# EAGLE design pdm_1-rev0 (EAGLE 7.5.0)
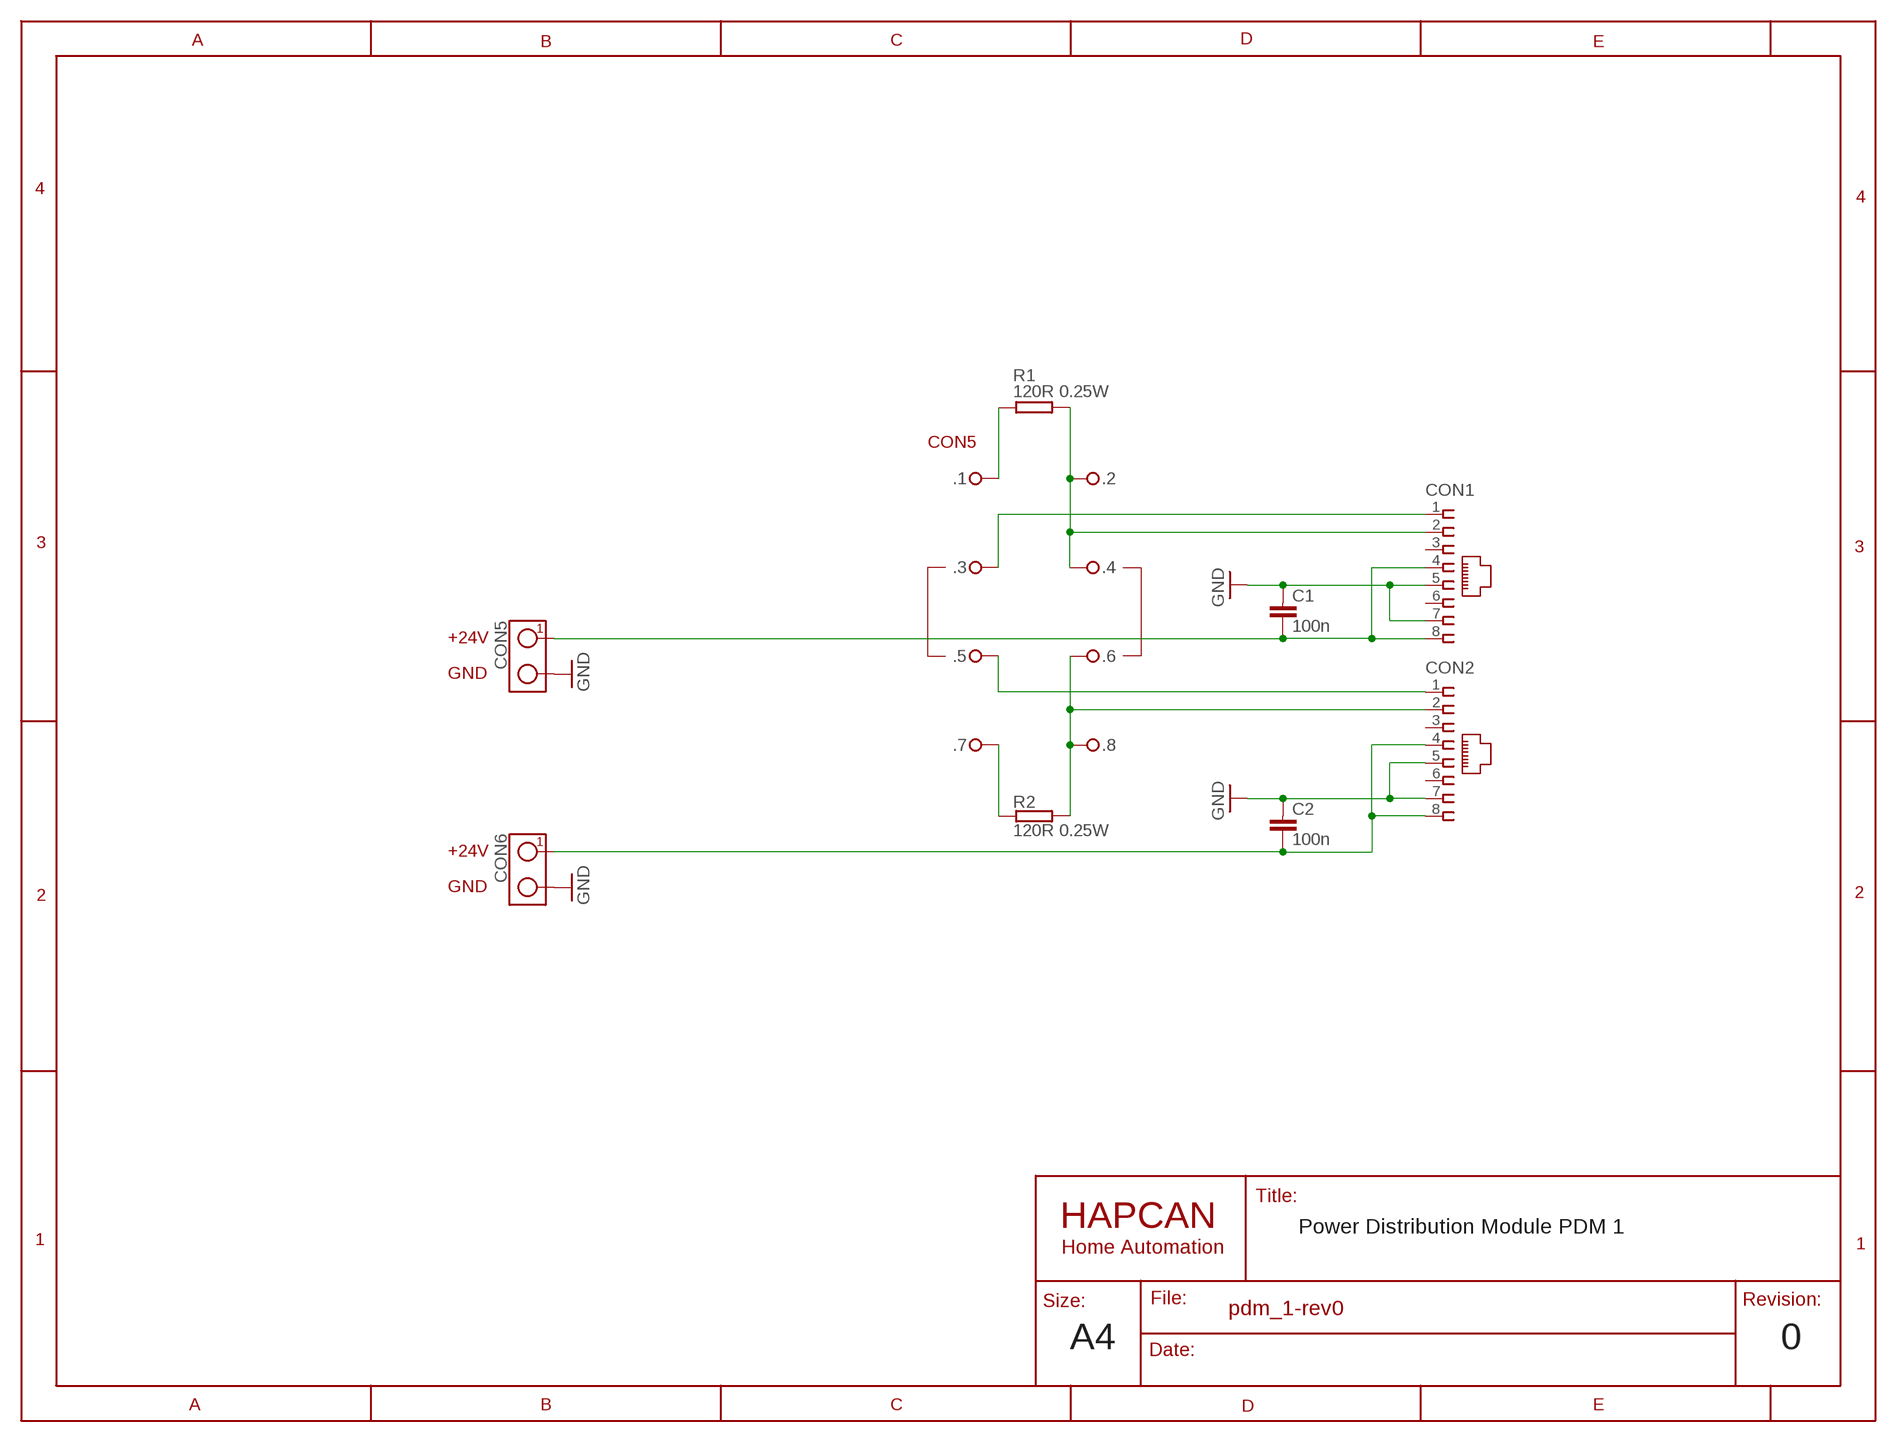
[diagram p0: schematic, sheet 1]

## Parts
.  2x4  HEADER2X4_NORMAL  [HEADER-2X4]
C1  100n  CAPACITOR0805  [0805]
C2  100n  CAPACITOR0805  [0805]
CON1  RJ45-SOCKET  [RJ45-PCB-SOCKET]
CON2  RJ45-SOCKET  [RJ45-PCB-SOCKET]
CON5  TERMINAL-2-7.5X10.5MM  [ARK2-7.5X10.5MM]
CON6  TERMINAL-2-7.5X10.5MM  [ARK2-7.5X10.5MM]
R1  120R 0.25W  RESISTOR2010  [2010]
R2  120R 0.25W  RESISTOR2010  [2010]

## Nets
GND: C1.1 C2.1 CON1.5 CON1.7 CON2.5 CON2.7 CON5.2 CON6.2
N$1: ..3 CON1.1
N$2: ..2 ..4 CON1.2 R1.2
N$4: ..5 CON2.1
N$5: C1.2 CON1.4 CON1.8 CON5.1
N$6: ..1 R1.1
N$8: ..7 R2.1
N$9: C2.2 CON2.4 CON2.8 CON6.1
N$10: ..6 ..8 CON2.2 R2.2
Unconnected: CON1.3 CON1.6 CON2.3 CON2.6

## Notes on the sheet
- CON5
- +24V
- GND
- +24V
- GND
- Power Distribution Module PDM 1
- A4 | 0

## Library data of the parts
. = HAPCAN_devices - UNIV3:HEADER2X4: 8pin connector 2.54 raster
C1 C2 = HAPCAN_devices - UNIV3:CAPACITOR: HAPCAN Capacitor
CON1 CON2 = HAPCAN_devices - UNIV3:RJ45-SOCKET: HAPCAN RJ45 socket
CON5 CON6 = HAPCAN_devices - UNIV3:TERMINAL-2: HAPCAN Terminal Block - 2 way
R1 R2 = HAPCAN_devices - UNIV3:RESISTOR: HAPCAN Resistor

## Board
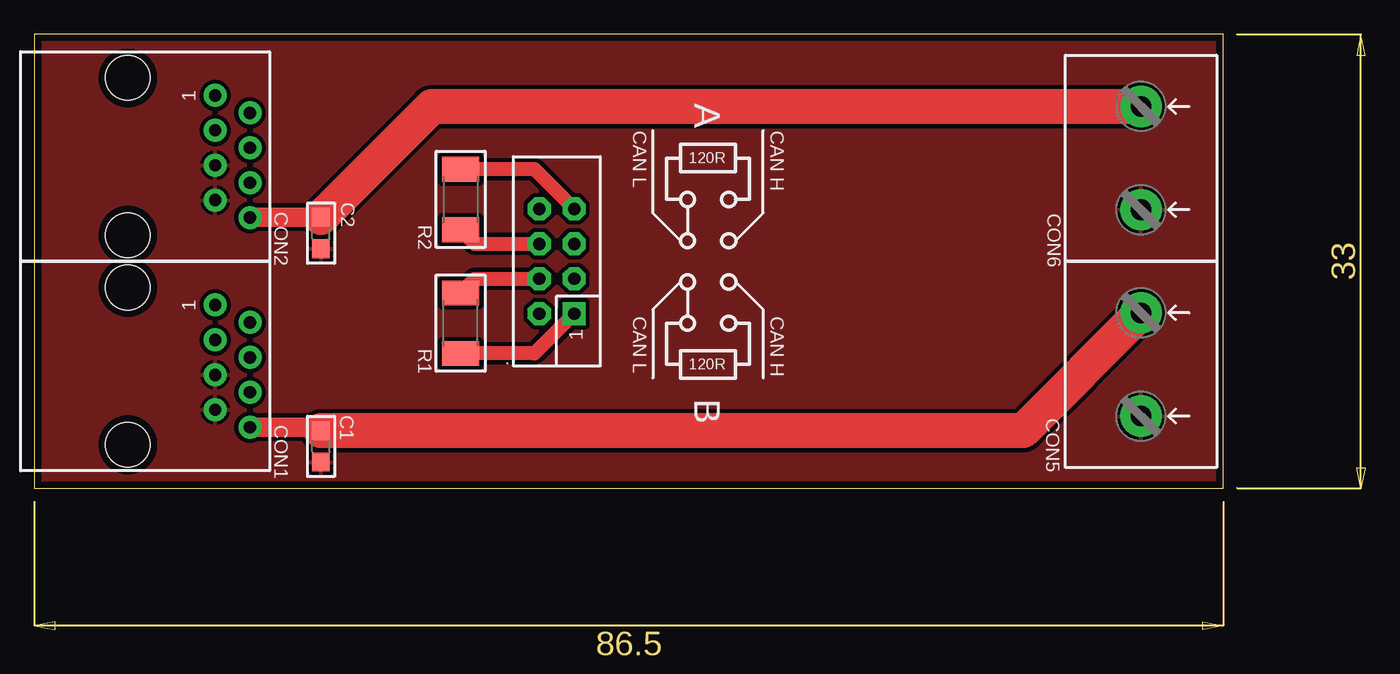
[diagram p1: board, top side]
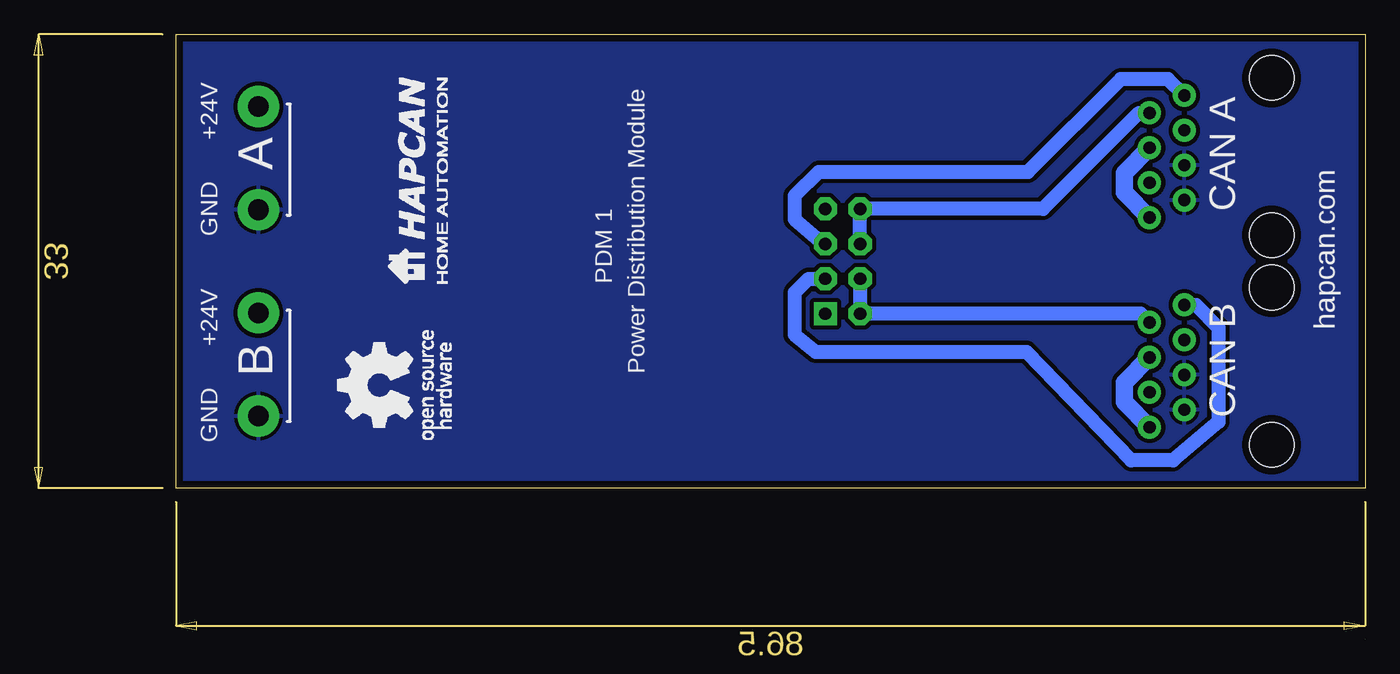
[diagram p2: board, bottom side, seen from below]

Size 86.5 x 44 mm. Coordinates in mm from the lower left corner, seen from the top.
Outline: 0,0.01 0,0
Outline: 0,1 0,10
Outline: 0,44 0,11 86.5,11 86.5,44 0,44
Copper layers (1*16): Top 0.035mm / dielectric 1.5mm / Bottom 0.035mm
Design rules "HAPCAN-Drc *": minimum track width 12mil, minimum drill 0.5mm, track to track 12mil, track to pad 12mil, pad to pad 12mil, via to via 12mil, smd to smd 10mil, copper to edge 20mil, drill to drill 8mil, minimum pad ring 10mil, minimum via ring 10mil, stop-mask expansion 4mil, vias tented up to drill 0mil, thermal gap 10mil
tKeepout: 4 lines

### Footprints (pad centres in the part's own frame; a part is rotated, then mirrored left to right if it is on the bottom)
HEADER-2X4 = drill 0.9 pad 1.676 square: 1 -3.81,-1.27 | drill 0.9 pad 1.676 octagon: 2 -3.81,1.27; 3 -1.27,-1.27; 4 -1.27,1.27; 5 1.27,-1.27; 6 1.27,1.27; 7 3.81,-1.27; 8 3.81,1.27
0805 = smd 1.372 x 1.27: 1 -1.143,0; 2 1.143,0
RJ45-PCB-SOCKET = drill 0.9 pad 1.676: 1 -4.445,6.35; 2 -3.175,8.89; 3 -1.905,6.35; 4 -0.635,8.89; 5 0.635,6.35; 6 1.905,8.89; 7 3.175,6.35; 8 4.445,8.89 | hole 3.251: -5.715,0; 5.715,0
ARK2-7.5X10.5MM = drill 1.5 pad 3: 1 -3.75,0; 2 3.75,0
2010 = smd 1.8 x 2.7: 1 -2.2,0; 2 2.2,0

### Placement (x,y rotation side)
.  38,27.5 90 top
C1  20.84,14.05 90 top
C2  20.84,29.55 90 top
CON1  6.8,19.88 270 top
CON2  6.8,35.12 270 top
CON5  80.5,20 270 top
CON6  80.5,35 270 top
R1  31,23 90 top
R2  31,32 270 top

### Tracks (layer width: path | path; a pad name or v marks a point on that pad's centre or on a via)
GND
  pour Bottom: 86.5,44 86.5,11 0,11 0,44
  pour Top: 0,44 86.5,44 86.5,11 0,11
N$1
  Bottom 1.016: CON1.1 12.31,24.32 10.67,22.68 10.67,15.83 13.97,13.03 17.02,13.03 24.64,20.91 39.97,20.91 41.5,22.18 41.5,25.22 40.49,26.23 ..3
N$2
  Top 1.016: R1.2 32.03,26.23 ..4
  Bottom 1.016: ..4 ..2 16.32,23.69 CON1.2
N$4
  Bottom 1.016: CON2.1 14.34,40.75 17.77,40.75 24.52,34.01 39.75,34.01 41.5,32.26 41.5,30.56 39.46,28.77 ..5
N$5
  Top 1.422: C1.2 20.6,15.43 CON1.8
  Top 2.54: CON5.1 71.94,15.19 C1.2
  Bottom 1.27: CON1.4 17.5,18.68 17.5,17.27 CON1.8
N$6
  Top 1.016: ..1 36.38,20.8 R1.1
N$8
  Top 1.016: ..7 36.38,34.2 R2.1
N$9
  Top 1.422: C2.2 15.71,30.69 CON2.8
  Top 2.54: C2.2 28.9,38.75 CON6.1
  Bottom 1.27: CON2.4 17.5,33.92 17.5,32.51 CON2.8
N$10
  Top 1.016: R2.2 32.03,28.77 ..6
  Bottom 1.016: 15.71,38.3 CON2.2 16.45,38.3 23.44,31.31 ..8 ..6

### Text on the board
tPlace: A | CAN L | CAN H | 120R | CAN L | CAN H | 120R | B
bPlace: Power Distribution Module | +24V | hapcan.com | A | CAN A | PDM 1 | GND | +24V | B | CAN B | GND